# EAGLE design TFT_Interface (EAGLE 6.5.0)
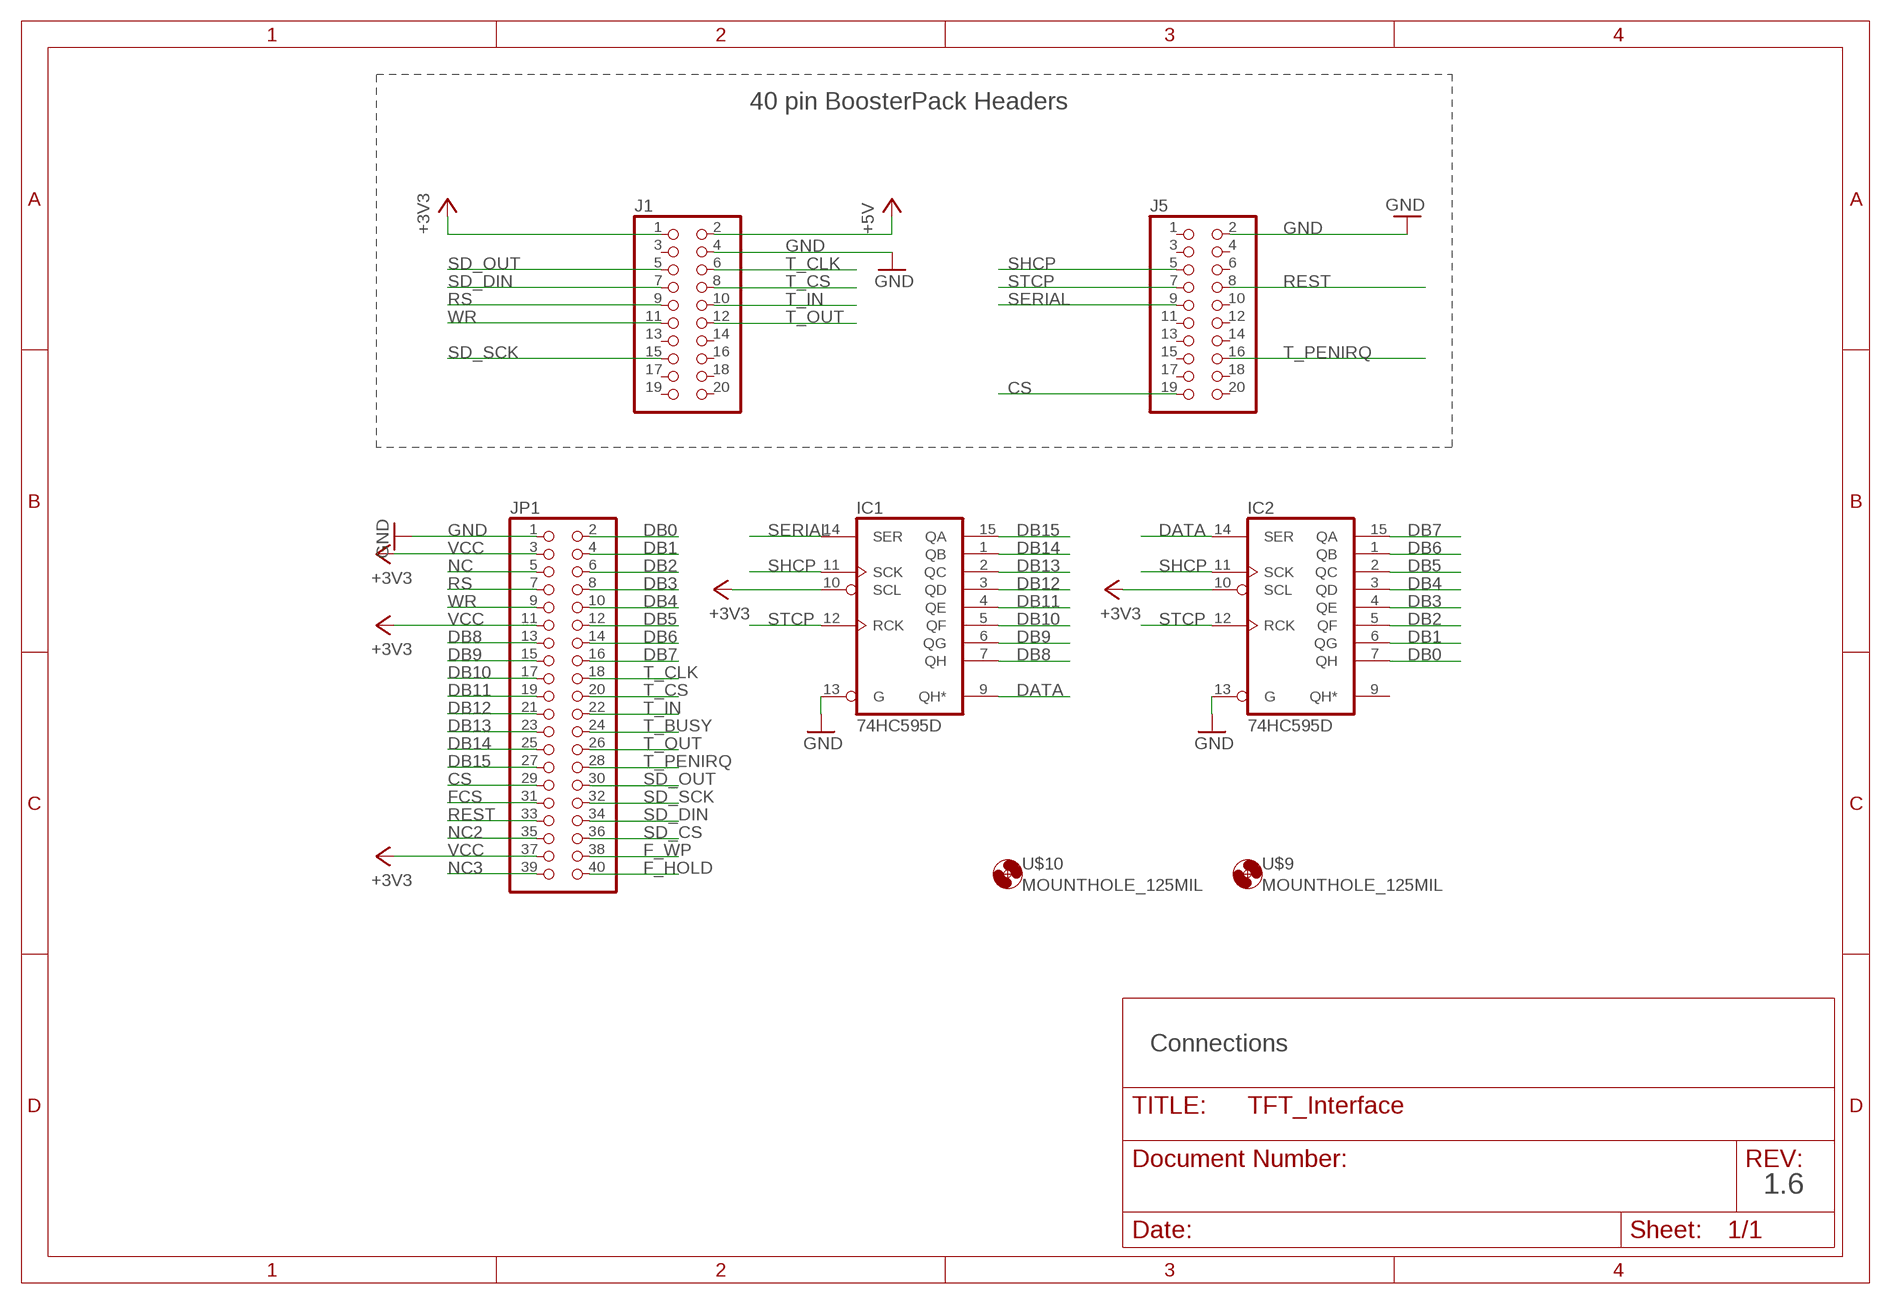
[diagram p0: schematic, sheet 1]

## Parts
IC1  74HC595D  [SO16]
IC2  74HC595D  [SO16]
J1  PINHD-2X10  [2X10]
J5  PINHD-2X10  [2X10]
JP1  PINHD-2X20  [2X20]
U$9  MOUNTHOLE_125MIL  [MOUNTHOLE_125MIL]
U$10  MOUNTHOLE_125MIL  [MOUNTHOLE_125MIL]

## Nets
+5V [Power]: J1.2
CS: J5.19 JP1.29
DATA: IC1.9(QH*) IC2.14(SER)
DB0: IC2.7(QH) JP1.2
DB1: IC2.6(QG) JP1.4
DB2: IC2.5(QF) JP1.6
DB3: IC2.4(QE) JP1.8
DB4: IC2.3(QD) JP1.10
DB5: IC2.2(QC) JP1.12
DB6: IC2.1(QB) JP1.14
DB7: IC2.15(QA) JP1.16
DB8: IC1.7(QH) JP1.13
DB9: IC1.6(QG) JP1.15
DB10: IC1.5(QF) JP1.17
DB11: IC1.4(QE) JP1.19
DB12: IC1.3(QD) JP1.21
DB13: IC1.2(QC) JP1.23
DB14: IC1.1(QB) JP1.25
DB15: IC1.15(QA) JP1.27
F_HOLD: JP1.40
F_WP: JP1.38
FCS: JP1.31
GND [Ground]: IC1.13(G) IC2.13(G) J1.4 J5.2 JP1.1
NC: JP1.5
NC2: JP1.35
NC3: JP1.39
REST: J5.8 JP1.33
RS: J1.9 JP1.7
SD_CS: JP1.36
SD_DIN: J1.7 JP1.34
SD_OUT: J1.5 JP1.30
SD_SCK: J1.15 JP1.32
SERIAL: IC1.14(SER) J5.9
SHCP: IC1.11(SCK) IC2.11(SCK) J5.5
STCP: IC1.12(RCK) IC2.12(RCK) J5.7
T_BUSY: JP1.24
T_CLK: J1.6 JP1.18
T_CS: J1.8 JP1.20
T_IN: J1.10 JP1.22
T_OUT: J1.12 JP1.26
T_PENIRQ: J5.16 JP1.28
VCC: IC1.10(SCL) IC2.10(SCL) J1.1 JP1.3 JP1.11 JP1.37 ; supply symbol labelled +3V3
WR: J1.11 JP1.9
Unconnected: IC2.9(QH*) J1.3 J1.13 J1.14 J1.16 J1.17 J1.18 J1.19 J1.20 J5.1 J5.3 J5.4 J5.6 J5.10 J5.11 J5.12 J5.13 J5.14 J5.15 J5.17 J5.18 J5.20

## Notes on the sheet
- 40 pin BoosterPack Headers
- Connections
- 1.6

## Power pins joined to a net without a drawn wire
GND: IC1.8(GND) IC2.8(GND)
VCC: IC1.16(VCC) IC2.16(VCC)

## Library data of the parts
IC1 IC2 = 74xx-eu:74*595: 8-bit SHIFT REGISTER, output latch
J1 J5 = pinhead:PINHD-2X10: PIN HEADER
JP1 = pinhead:PINHD-2X20: PIN HEADER
U$9 U$10 = MSP-EXP432:MOUNTHOLE_125MIL

## Net classes
0 Default: width 0.203 mm, drill 0.508 mm, clearance 0.254 mm
1 Ground: width 0.203 mm, drill 0.508 mm, clearance 0.254 mm to class 0, clearance 0.152 mm
2 Power: width 0.381 mm, drill 0.508 mm, clearance 0.254 mm to class 0, clearance 0.152 mm to class 1, clearance 0.152 mm

## Board
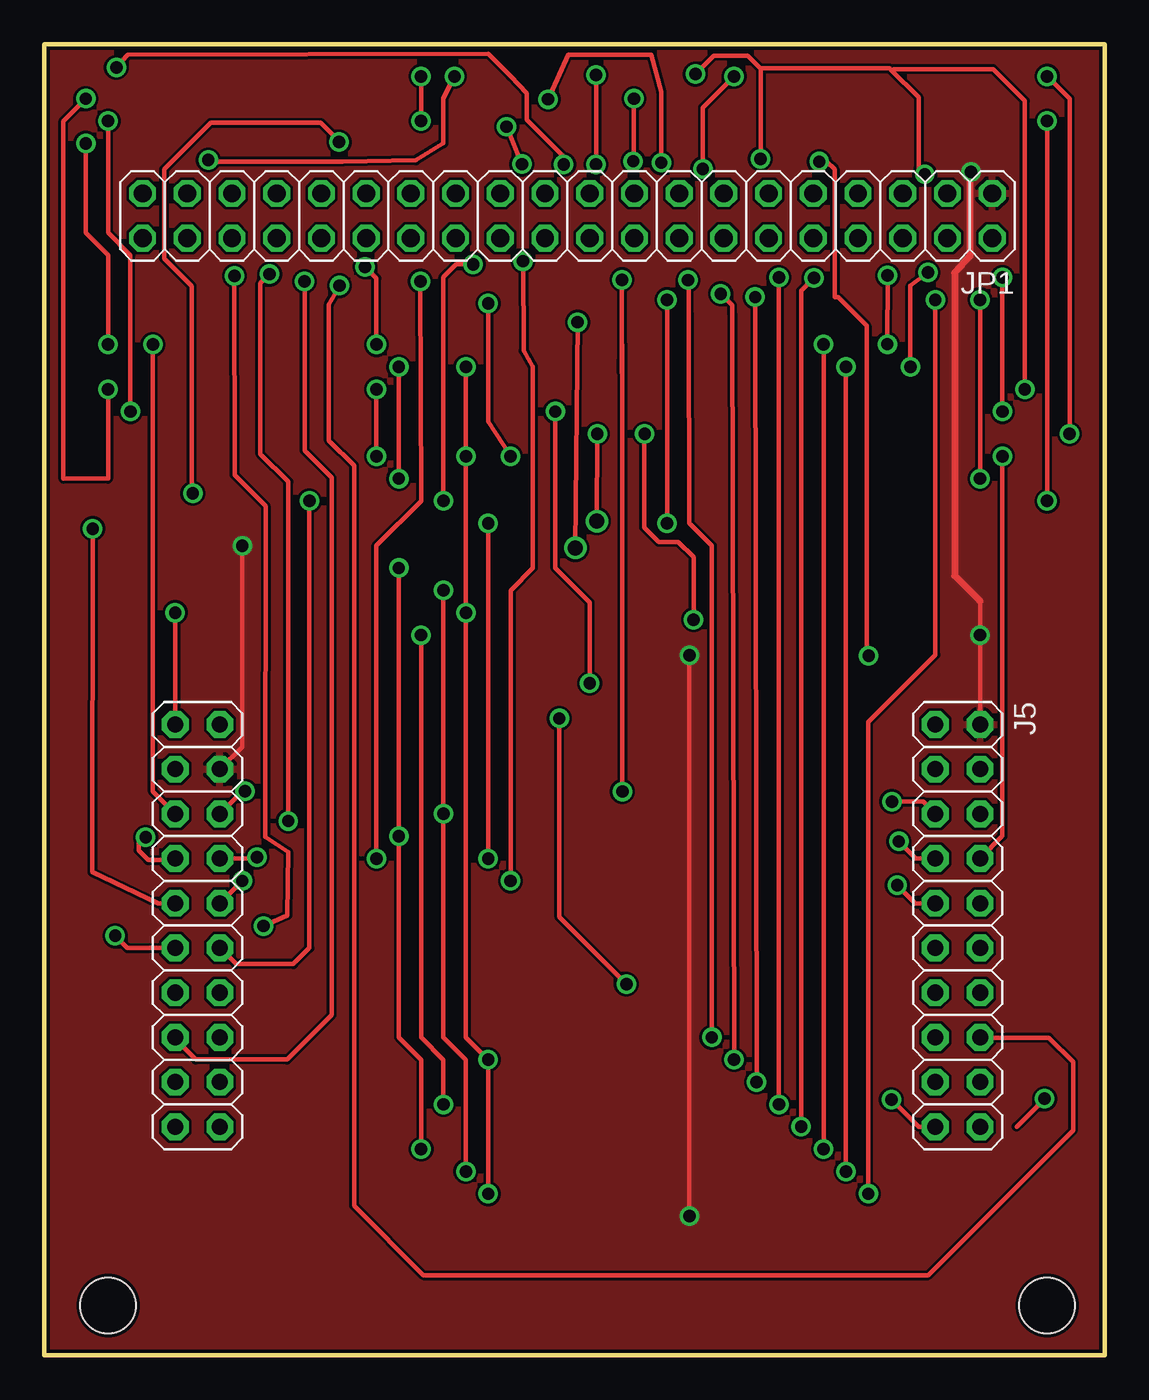
[diagram p1: board, top side]
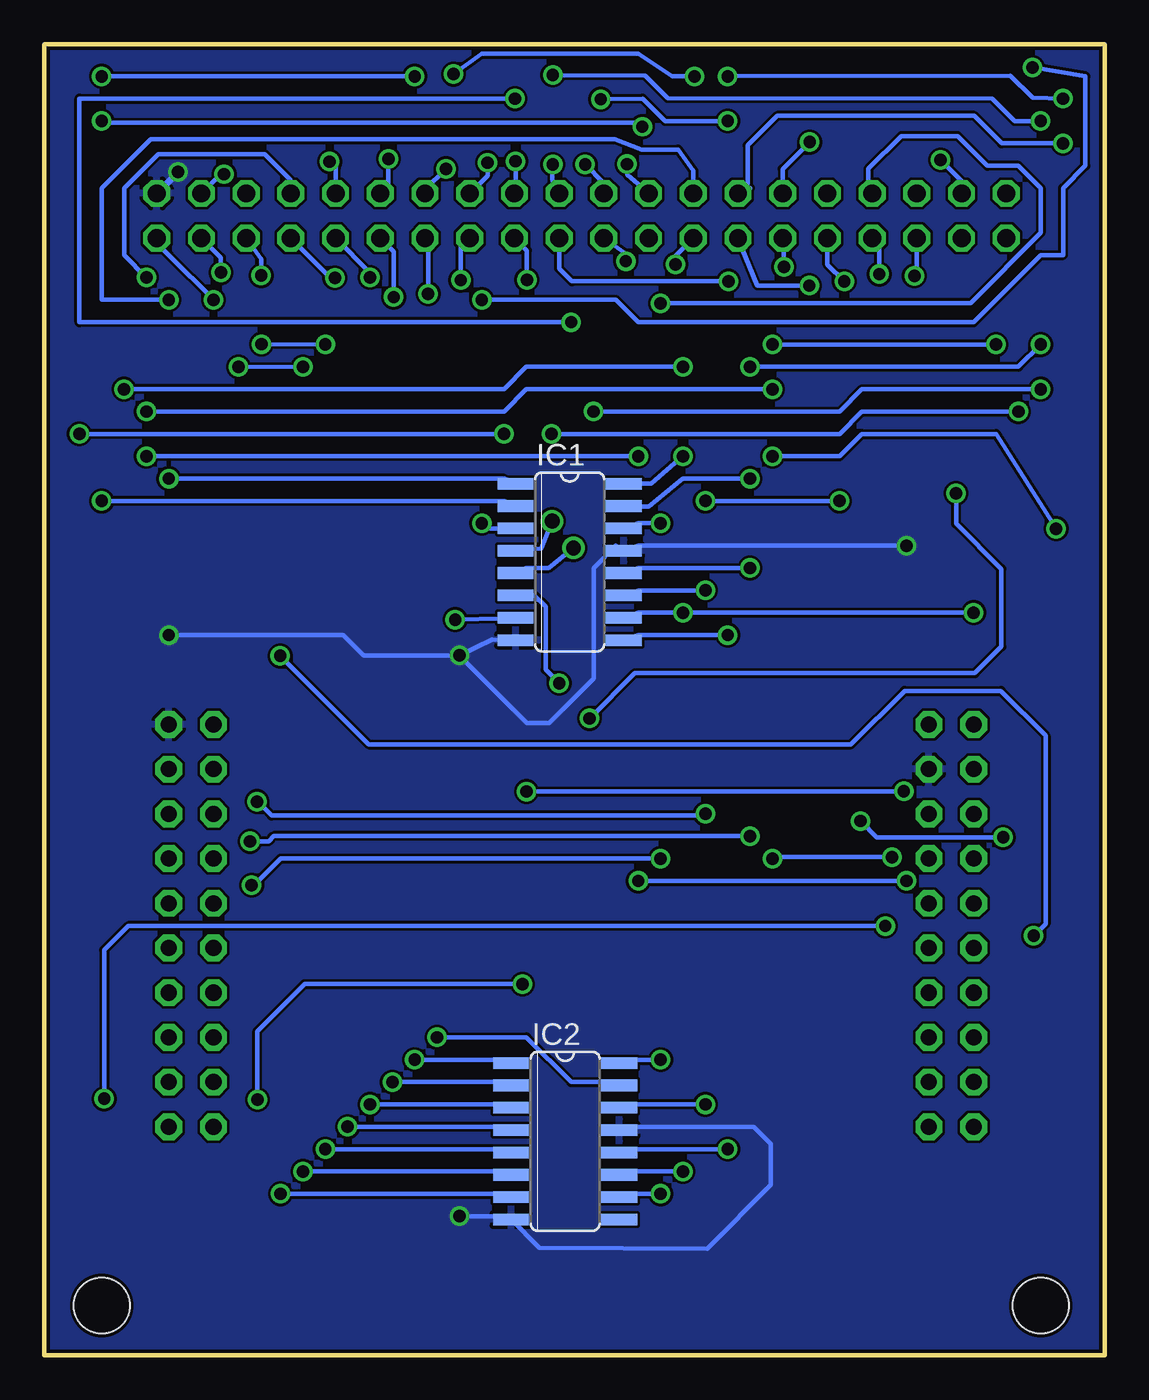
[diagram p2: board, bottom side, seen from below]

Size 60.26 x 74.53 mm. Coordinates in mm from the lower left corner, seen from the top.
Outline: 0,0 0,74.53 60.26,74.53 60.26,0 0,0
Copper layers (1*16): Top 0.0178mm / dielectric 12mil / Bottom 0.0178mm
Design rules "default *": minimum track width 6mil, minimum drill 12mil, track to track 6mil, track to pad 6mil, pad to pad 6mil, via to via 8mil, smd to smd 6mil, copper to edge 8mil, drill to drill 7mil, minimum pad ring 10mil, minimum via ring 8mil, stop-mask expansion 8mil, vias tented up to drill 15mil, thermal gap 8mil

### Footprints (pad centres in the part's own frame; a part is rotated, then mirrored left to right if it is on the bottom)
SO16 = smd 0.66 x 2.032: 1 -4.445,-3.073; 2 -3.175,-3.073; 3 -1.905,-3.073; 4 -0.635,-3.073; 5 0.635,-3.073; 6 1.905,-3.073; 7 3.175,-3.073; 8 4.445,-3.073; 9 4.445,3.073; 10 3.175,3.073; 11 1.905,3.073; 12 0.635,3.073; 13 -0.635,3.073; 14 -1.905,3.073; 15 -3.175,3.073; 16 -4.445,3.073
2X10 = drill 0.914 pad 1.524 octagon: 1 -11.43,-1.27; 2 -11.43,1.27; 3 -8.89,-1.27; 4 -8.89,1.27; 5 -6.35,-1.27; 6 -6.35,1.27; 7 -3.81,-1.27; 8 -3.81,1.27; 9 -1.27,-1.27; 10 -1.27,1.27; 11 1.27,-1.27; 12 1.27,1.27; 13 3.81,-1.27; 14 3.81,1.27; 15 6.35,-1.27; 16 6.35,1.27; 17 8.89,-1.27; 18 8.89,1.27; 19 11.43,-1.27; 20 11.43,1.27
2X20 = drill 1.016 octagon: 1 -24.13,-1.27; 2 -24.13,1.27; 3 -21.59,-1.27; 4 -21.59,1.27; 5 -19.05,-1.27; 6 -19.05,1.27; 7 -16.51,-1.27; 8 -16.51,1.27; 9 -13.97,-1.27; 10 -13.97,1.27; 11 -11.43,-1.27; 12 -11.43,1.27; 13 -8.89,-1.27; 14 -8.89,1.27; 15 -6.35,-1.27; 16 -6.35,1.27; 17 -3.81,-1.27; 18 -3.81,1.27; 19 -1.27,-1.27; 20 -1.27,1.27; 21 1.27,-1.27; 22 1.27,1.27; 23 3.81,-1.27; 24 3.81,1.27; 25 6.35,-1.27; 26 6.35,1.27; 27 8.89,-1.27; 28 8.89,1.27; 29 11.43,-1.27; 30 11.43,1.27; 31 13.97,-1.27; 32 13.97,1.27; 33 16.51,-1.27; 34 16.51,1.27; 35 19.05,-1.27; 36 19.05,1.27; 37 21.59,-1.27; 38 21.59,1.27; 39 24.13,-1.27; 40 24.13,1.27
MOUNTHOLE_125MIL = hole 3.175: 0,0

### Placement (x,y rotation side)
IC1  30.4,45.1 270 bottom
IC2  30.65,12.17 270 bottom
J1  8.72,24.43 270 top
J5  51.9,24.43 270 top
JP1  29.73,64.76 180 top
U$9  56.98,2.84 0 top
U$10  3.64,2.84 0 top

### Tracks (layer width: path | path; a pad name or v marks a point on that pad's centre or on a via)
CS  (via drill 0.7)
  Top 0.254: J5.19 49.68,13 v48.14,14.54 | v33.08,21.11 29.27,24.92 v29.27,36.2 | v8.45,48.99 8.38,49.07 8.38,60.78 6.83,62.33 6.83,67.4 9.47,70.04 15.73,70.04 16.76,69.01 v16.76,68.95
  Bottom 0.254: v48.14,14.54 48.14,18.42 45.45,21.11 v33.08,21.11 | v29.27,36.2 26.69,38.78 7.38,38.78 5.88,40.28 5.88,44.69 8.45,47.27 v8.45,48.99 | v16.76,68.95 18.3,67.42 JP1.29
DATA  (via drill 0.7)
  Top 0.254: v22.69,14.27 22.69,16.81 21.42,18.08 v21.42,40.94
  Bottom 0.254: v22.69,14.27 27.77,14.27 IC2.14 | v21.42,40.94 26.5,40.94 IC1.9
DB0  (via drill 0.7)
  Top 0.254: v46.82,9.19 46.82,36 50.63,39.81 v50.63,59.99
  Bottom 0.254: v46.82,9.19 34.12,9.19 IC2.7 | JP1.2 53.83,63.18 53.17,62.53 v50.63,59.99
DB1  (via drill 0.7)
  Top 0.254: v45.55,56.18 v45.55,10.46 | v49.22,56.18 49.22,60.79 v50.21,61.54
  Bottom 0.254: v45.55,10.46 34.12,10.46 IC2.6 | v49.22,56.18 v45.55,56.18 | v50.21,61.54 50.21,62.39 JP1.4
DB2  (via drill 0.7)
  Top 0.254: v47.9,57.47 v47.92,61.37 | v44.28,11.73 v44.28,57.45
  Bottom 0.254: v44.28,57.45 v47.9,57.47 | v44.28,11.73 34.12,11.73 IC2.5 | v47.92,61.37 47.91,62.29 JP1.6
DB3  (via drill 0.7)
  Top 0.254: v43.01,13 43.01,60.5 v43.74,61.23
  Bottom 0.254: v43.01,13 34.12,13 IC2.4 | v43.74,61.23 43.97,61.23 JP1.8
DB4  (via drill 0.7)
  Top 0.254: v41.74,61.26 v41.74,14.27
  Bottom 0.254: v41.74,14.27 34.12,14.27 IC2.3 | v41.74,61.26 41.74,61.54 JP1.10
DB5  (via drill 0.7)
  Top 0.254: v40.4,60.15 v40.47,15.54
  Bottom 0.254: v40.47,15.54 34.12,15.54 IC2.2 | v40.4,60.15 40.4,62.73 JP1.12
DB6  (via drill 0.7)
  Top 0.254: v39.2,16.81 39.09,59.21 39.09,59.68 v38.44,60.33
  Bottom 0.254: v39.2,16.81 34.12,16.81 IC2.1 | v38.44,60.33 38.44,63.32 JP1.14
DB7  (via drill 0.7)
  Top 0.254: v37.93,18.08 37.93,46.02 36.66,47.29 36.62,59.27 36.62,61.07 v36.58,61.11
  Bottom 0.254: v37.93,18.08 32.85,18.08 30.31,15.54 27.77,15.54 IC2.15 | v36.58,61.11 36.58,62.99 JP1.16
DB8  (via drill 0.7)
  Top 0.254: v56.98,72.69 58.25,71.42 v58.25,52.37 | v39.2,72.69 37.42,70.91 v37.42,67.43 | v36.9,41.81 36.9,45.37 36.04,46.23 34.92,46.23 34.09,47.05 34.09,52.34 v34.12,52.37
  Bottom 0.254: v56.98,72.69 v39.2,72.69 | v34.12,52.37 v58.25,52.37 | v36.9,41.81 34.19,41.89 IC1.7 | v37.42,67.43 38.62,66.24 JP1.13
DB9  (via drill 0.7)
  Top 0.254: v28.63,71.38 29.78,73.92 34.5,73.92 35.06,71.81 v35.06,67.78 | v21.42,72.69 v21.42,70.15 | v2.37,71.42 1.1,70.15 1.1,49.83 3.64,49.83 v3.64,54.91 | v29.04,53.64 29.04,44.75 31,42.8 v31,38.2
  Bottom 0.254: v28.63,71.38 26.25,71.42 24.98,70.15 v21.42,70.15 | v21.42,72.69 5.36,72.73 4.09,71.46 v2.37,71.42 | v3.64,54.91 13.8,54.91 15.07,53.64 v29.04,53.64 | v35.06,67.78 35.06,67.05 JP1.15 | IC1.6 32.41,43.19 31.77,42.55 31.77,38.97 v31,38.2
DB10  (via drill 0.7, 0.85)
  Top 0.254: v30.18,45.89 v30.31,58.72 | v33.51,71.42 33.51,67.9 v33.47,67.86
  Bottom 0.254: v33.51,71.42 58.25,71.42 58.25,58.72 v30.31,58.72 | v30.18,45.89 31.58,44.75 32.85,44.75 IC1.5 | v33.47,67.86 33.47,66.1 JP1.17
DB11  (via drill 0.7, 0.85)
  Top 0.254: v31.36,72.76 v31.36,67.68 | v3.64,70.15 3.64,63.8 4.91,62.53 v4.91,53.64 | v31.4,47.41 v31.43,52.37
  Bottom 0.254: v31.36,67.68 31.38,66.86 31.15,66.05 JP1.19 | v31.36,72.76 26.11,72.73 24.84,71.46 6.39,71.42 5.12,70.15 v3.64,70.15 | v4.91,53.64 13.8,53.64 15.07,52.37 v31.43,52.37 | v31.4,47.41 32.01,45.85 33.02,45.76 IC1.4
DB12  (via drill 0.7)
  Top 0.254: v4.11,73.19 4.76,73.92 25.23,73.96 26.5,72.69 27.41,71.74 27.41,70.22 29.52,68.11 v29.52,67.68 | v35.39,47.29 v35.39,59.99
  Bottom 0.254: v4.11,73.19 1.1,72.69 1.1,67.61 2.37,66.34 2.37,62.53 3.64,62.53 7.45,58.72 26.5,58.72 27.77,59.99 v35.39,59.99 | v35.39,47.29 34.9,46.99 IC1.3 | JP1.21 28.46,66.62 v29.52,67.68
DB13  (via drill 0.7)
  Top 0.254: v26.28,69.83 v27.15,67.7 | v56.98,48.56 v56.98,70.15
  Bottom 0.254: v56.98,48.56 34.12,48.56 IC1.2 | v56.98,70.15 56.87,70.04 26.49,70.04 v26.28,69.83 | v27.15,67.7 27.13,67.09 JP1.23
DB14  (via drill 0.7)
  Top 0.254: v53.17,49.83 v53.17,59.99
  Bottom 0.254: v53.17,59.99 56.98,59.99 56.98,66.34 54.2,69.12 27.83,69.12 26.31,68.53 24.24,68.53 23.38,67.32 JP1.25 | v53.17,49.83 34.12,49.83 IC1.1
DB15  (via drill 0.7)
  Top 0.254: v2.37,68.88 2.37,63.8 3.64,62.53 v3.64,57.45 | v20.15,49.83 v20.15,56.18
  Bottom 0.254: v3.64,57.45 4.91,56.18 v20.15,56.18 | v20.15,49.83 23.96,49.83 25.92,48.23 27.19,48.23 IC1.15 | 20.15,66.34 JP1.27 20.29,66.59 20.29,68.76 18.6,70.45 7.43,70.45 5.86,68.88 v2.37,68.88
GND  (via drill 0.7)
  Top 0.254: J1.4 11.26,34.59 v11.26,46.02 | J5.2 v53.17,40.94 53.17,42.87 | v36.66,39.79 v36.66,7.92 | v52.65,67.25 52.59,67.21
  Top 0.406: 52.59,67.21 52.59,62.47 51.72,61.52 51.72,44.32 53.17,42.87
  Bottom 0.254: IC2.13 27.77,13 19.94,13 18.97,12.03 18.97,9.7 22.59,6.08 32.12,6.12 IC2.8 34.12,7.92 v36.66,7.92 | 33.5,40.47 IC1.8 34.81,40.69 v36.66,39.79 | v11.26,46.02 26.5,46.02 IC1.13 27.77,46.02 29.04,44.75 29.04,38.47 31.56,35.95 32.83,35.95 v36.66,39.79 | 52.76,67.14 v52.65,67.25 | v36.66,39.79 36.68,39.77 42.09,39.77 43.26,40.94 v53.17,40.94
  Bottom 0.406: JP1.1 52.76,67.14
  pour Top: 60.18,75.14 60.18,-0.62 -0.15,-0.62 -0.15,74.99
  pour Bottom: 0.15,74.99 60.34,74.99 60.34,-0.47 0.31,-0.47 0.31,74.83
REST  (via drill 0.7)
  Top 0.254: J5.8 54.44,29.51 v54.44,51.1 | v26.5,51.1 25.23,53.08 v25.23,59.79
  Bottom 0.254: v26.5,51.1 v54.44,51.1 | v25.23,59.79 7.63,59.79 3.64,63.8 3.64,66.34 4.91,67.61 6.67,67.61 8.36,69.3 11.56,69.3 13.43,67.43 13.43,66.24 JP1.33
RS  (via drill 0.7)
  Top 0.254: v2.77,46.98 2.74,27.47 6.49,25.7 J1.9 | v18.88,54.91 v18.88,51.1 | v54.44,61.26 v54.44,53.64
  Bottom 0.254: v2.77,46.98 6.18,52.37 13.8,52.37 15.07,51.1 v18.88,51.1 | v18.88,54.91 32.85,54.91 34.12,53.64 v54.44,53.64 | v54.44,61.26 55.71,62.53 55.71,66.34 53.76,68.26 47.72,68.26 46.24,66.78 JP1.7
SD_CS  (via drill 0.7)
  Top 0.254: v56.84,14.59 55.25,13 | v12.47,24.41 13.83,25.01 13.86,28.62 12.57,29.48 12.59,48.28 10.83,50.04 v10.82,61.35
  Bottom 0.254: v12.47,24.41 55.47,24.41 56.84,23.04 v56.84,14.59 | v10.82,61.35 10.68,61.49 JP1.36
SD_DIN  (via drill 0.7)
  Top 0.254: v5.77,29.44 5.38,29.15 5.38,28.71 5.92,28.16 6.71,28.16 7.59,28.09 J1.7 | v13.87,30.37 13.87,49.65 12.29,51.23 12.29,60.93 v12.82,61.45
  Bottom 0.254: 5.84,29.51 v5.77,29.44 12.95,29.44 v13.87,30.37 | v12.82,61.45 12.82,63.09 JP1.34
SD_OUT  (via drill 0.7)
  Top 0.254: v18.88,57.45 18.88,61.21 v18.23,61.87 | v6.18,57.45 6.18,32.05 7.47,30.73 J1.5
  Bottom 0.254: v6.18,57.45 v18.88,57.45 | v18.23,61.87 18.23,63.43 JP1.30
SD_SCK  (via drill 0.7)
  Top 0.254: J1.15 7.45,17.98 8.61,16.82 13.82,16.82 16.34,19.35 16.34,49.88 14.8,51.42 v14.8,61.04
  Bottom 0.254: v14.8,61.04 15.76,62 JP1.32
SERIAL  (via drill 0.7)
  Top 0.254: v25.23,28.24 v25.23,47.29 | v48.47,26.72 49.49,25.7 J5.9
  Bottom 0.254: v25.23,47.29 26.5,47.29 IC1.14 | v25.23,28.24 46.82,28.24 48.34,26.72 v48.47,26.72
SHCP  (via drill 0.7)
  Top 0.254: v23.96,10.46 23.96,16.81 22.69,18.08 v22.69,30.78 v22.69,43.48 | v48.16,31.48 49.93,31.48 J5.5
  Bottom 0.254: v23.96,10.46 27.77,10.46 IC2.11 | v22.69,43.48 26.5,43.48 IC1.11 | v22.69,30.78 22.78,30.69 47.34,30.69 48.13,31.48 v48.16,31.48
STCP  (via drill 0.7)
  Top 0.254: v21.42,11.73 21.42,16.81 20.15,18.08 v20.15,29.51 v20.15,44.75 | v48.56,29.21 49.53,28.24 J5.7
  Bottom 0.254: v21.42,11.73 27.77,11.73 IC2.12 | v20.15,44.75 26.5,44.75 IC1.12 | v20.15,29.51 47.21,29.51 47.5,29.21 v48.56,29.21
T_CLK  (via drill 0.7)
  Top 0.254: v32.85,32.05 32.85,57.45 32.83,55.83 v32.83,61.13 | v11.42,32.07 11.28,32.07 J1.6
  Bottom 0.254: v32.85,32.05 11.44,32.05 arc-90 v11.42,32.07 | v32.83,61.13 32.83,62.79 JP1.18
T_CS  (via drill 0.7)
  Top 0.254: v21.38,61.04 21.42,48.56 18.88,46.02 v18.88,28.24 | v12.1,28.32 12.02,28.24 J1.8
  Bottom 0.254: v21.38,61.04 30.27,61.04 31,61.77 JP1.20 | v18.88,28.24 18.81,28.32 v12.1,28.32
T_IN  (via drill 0.7)
  Top 0.254: v26.5,26.97 26.5,43.48 27.77,44.75 27.77,56.18 27.25,57.09 v27.21,62.18 | v11.26,26.97 J1.10
  Bottom 0.254: v26.5,26.97 v11.26,26.97 | v27.21,62.18 27.21,62.61 JP1.22
T_OUT  (via drill 0.7)
  Top 0.254: v22.69,48.56 22.69,61.29 23.42,62.01 v24.38,62.01 | v15.07,48.56 15.07,23.16 14.16,22.25 10.91,22.25 J1.12
  Bottom 0.254: v15.07,48.56 v22.69,48.56 | v24.38,62.01 24.38,62.49 JP1.26
T_PENIRQ  (via drill 0.7)
  Top 0.254: J5.16 53.19,18.06 57.08,18.06 58.46,16.68 58.46,12.8 50.23,4.57 21.55,4.57 17.61,8.51 17.61,50.57 16.18,52 16.18,59.71 v16.79,60.8
  Bottom 0.254: v16.79,60.8 19.74,60.8 JP1.28
VCC  (via drill 0.7)
  Top 0.254: v23.32,72.69 22.69,71.42 22.69,68.88 21.12,67.91 16.98,67.85 9.42,67.85 v9.33,67.94 | v25.23,9.19 v25.23,16.81 23.96,18.08 v23.96,42.21 v23.96,51.1 v23.96,56.18 | v7.45,42.21 J1.1 | v55.71,54.91 55.71,71.3 53.91,73.1 48.27,73.1 48.1,73.08 | 40.7,73.13 39.97,73.86 38.05,73.86 v37,72.81 | 48.1,73.08 48.03,73.14 40.7,73.14 40.7,73.13 | 48.1,73.08 49.68,71.49 49.68,67.48 v50.03,67.13 | 40.7,73.13 40.7,68.15 v40.69,68
  Bottom 0.254: v23.32,72.69 24.59,72.69 26.5,73.96 35.39,73.96 v37,72.81 | JP1.11 40.71,66.34 40.71,67.61 40.69,67.63 v40.69,68 | v25.23,9.19 27.77,9.19 IC2.10 | v25.23,16.81 27.77,16.81 IC2.16 | v7.45,42.21 v23.96,42.21 26.5,42.21 IC1.10 | v23.96,51.1 25.77,49.56 27.04,49.56 IC1.16 | v55.71,54.91 34.12,54.91 32.85,56.18 v23.96,56.18 | v9.33,67.94 8.14,66.74 JP1.37 | v50.03,67.13 50.23,67.13 JP1.3
WR  (via drill 0.7)
  Top 0.254: v44.04,67.84 44.47,67.84 44.91,67.41 44.91,60.14 45.1,60.14 46.73,58.51 46.73,40.12 v46.84,39.76 | v4.04,23.85 4.73,23.16 J1.11
  Bottom 0.254: JP1.9 43.68,66.05 43.68,67.49 v44.04,67.84 | v46.84,39.76 41.81,34.72 14.42,34.72 11.38,37.77 5.91,37.77 3.36,35.22 3.36,24.53 v4.04,23.85